# EasyEDA schematic SCH_Infotiv_2023-08-07.json
TITLE: Sheet_1; REV: 1.0; Date: 2023-07-14; Sheet: 1/1; Drawn By: Seamus; Company: Your Company
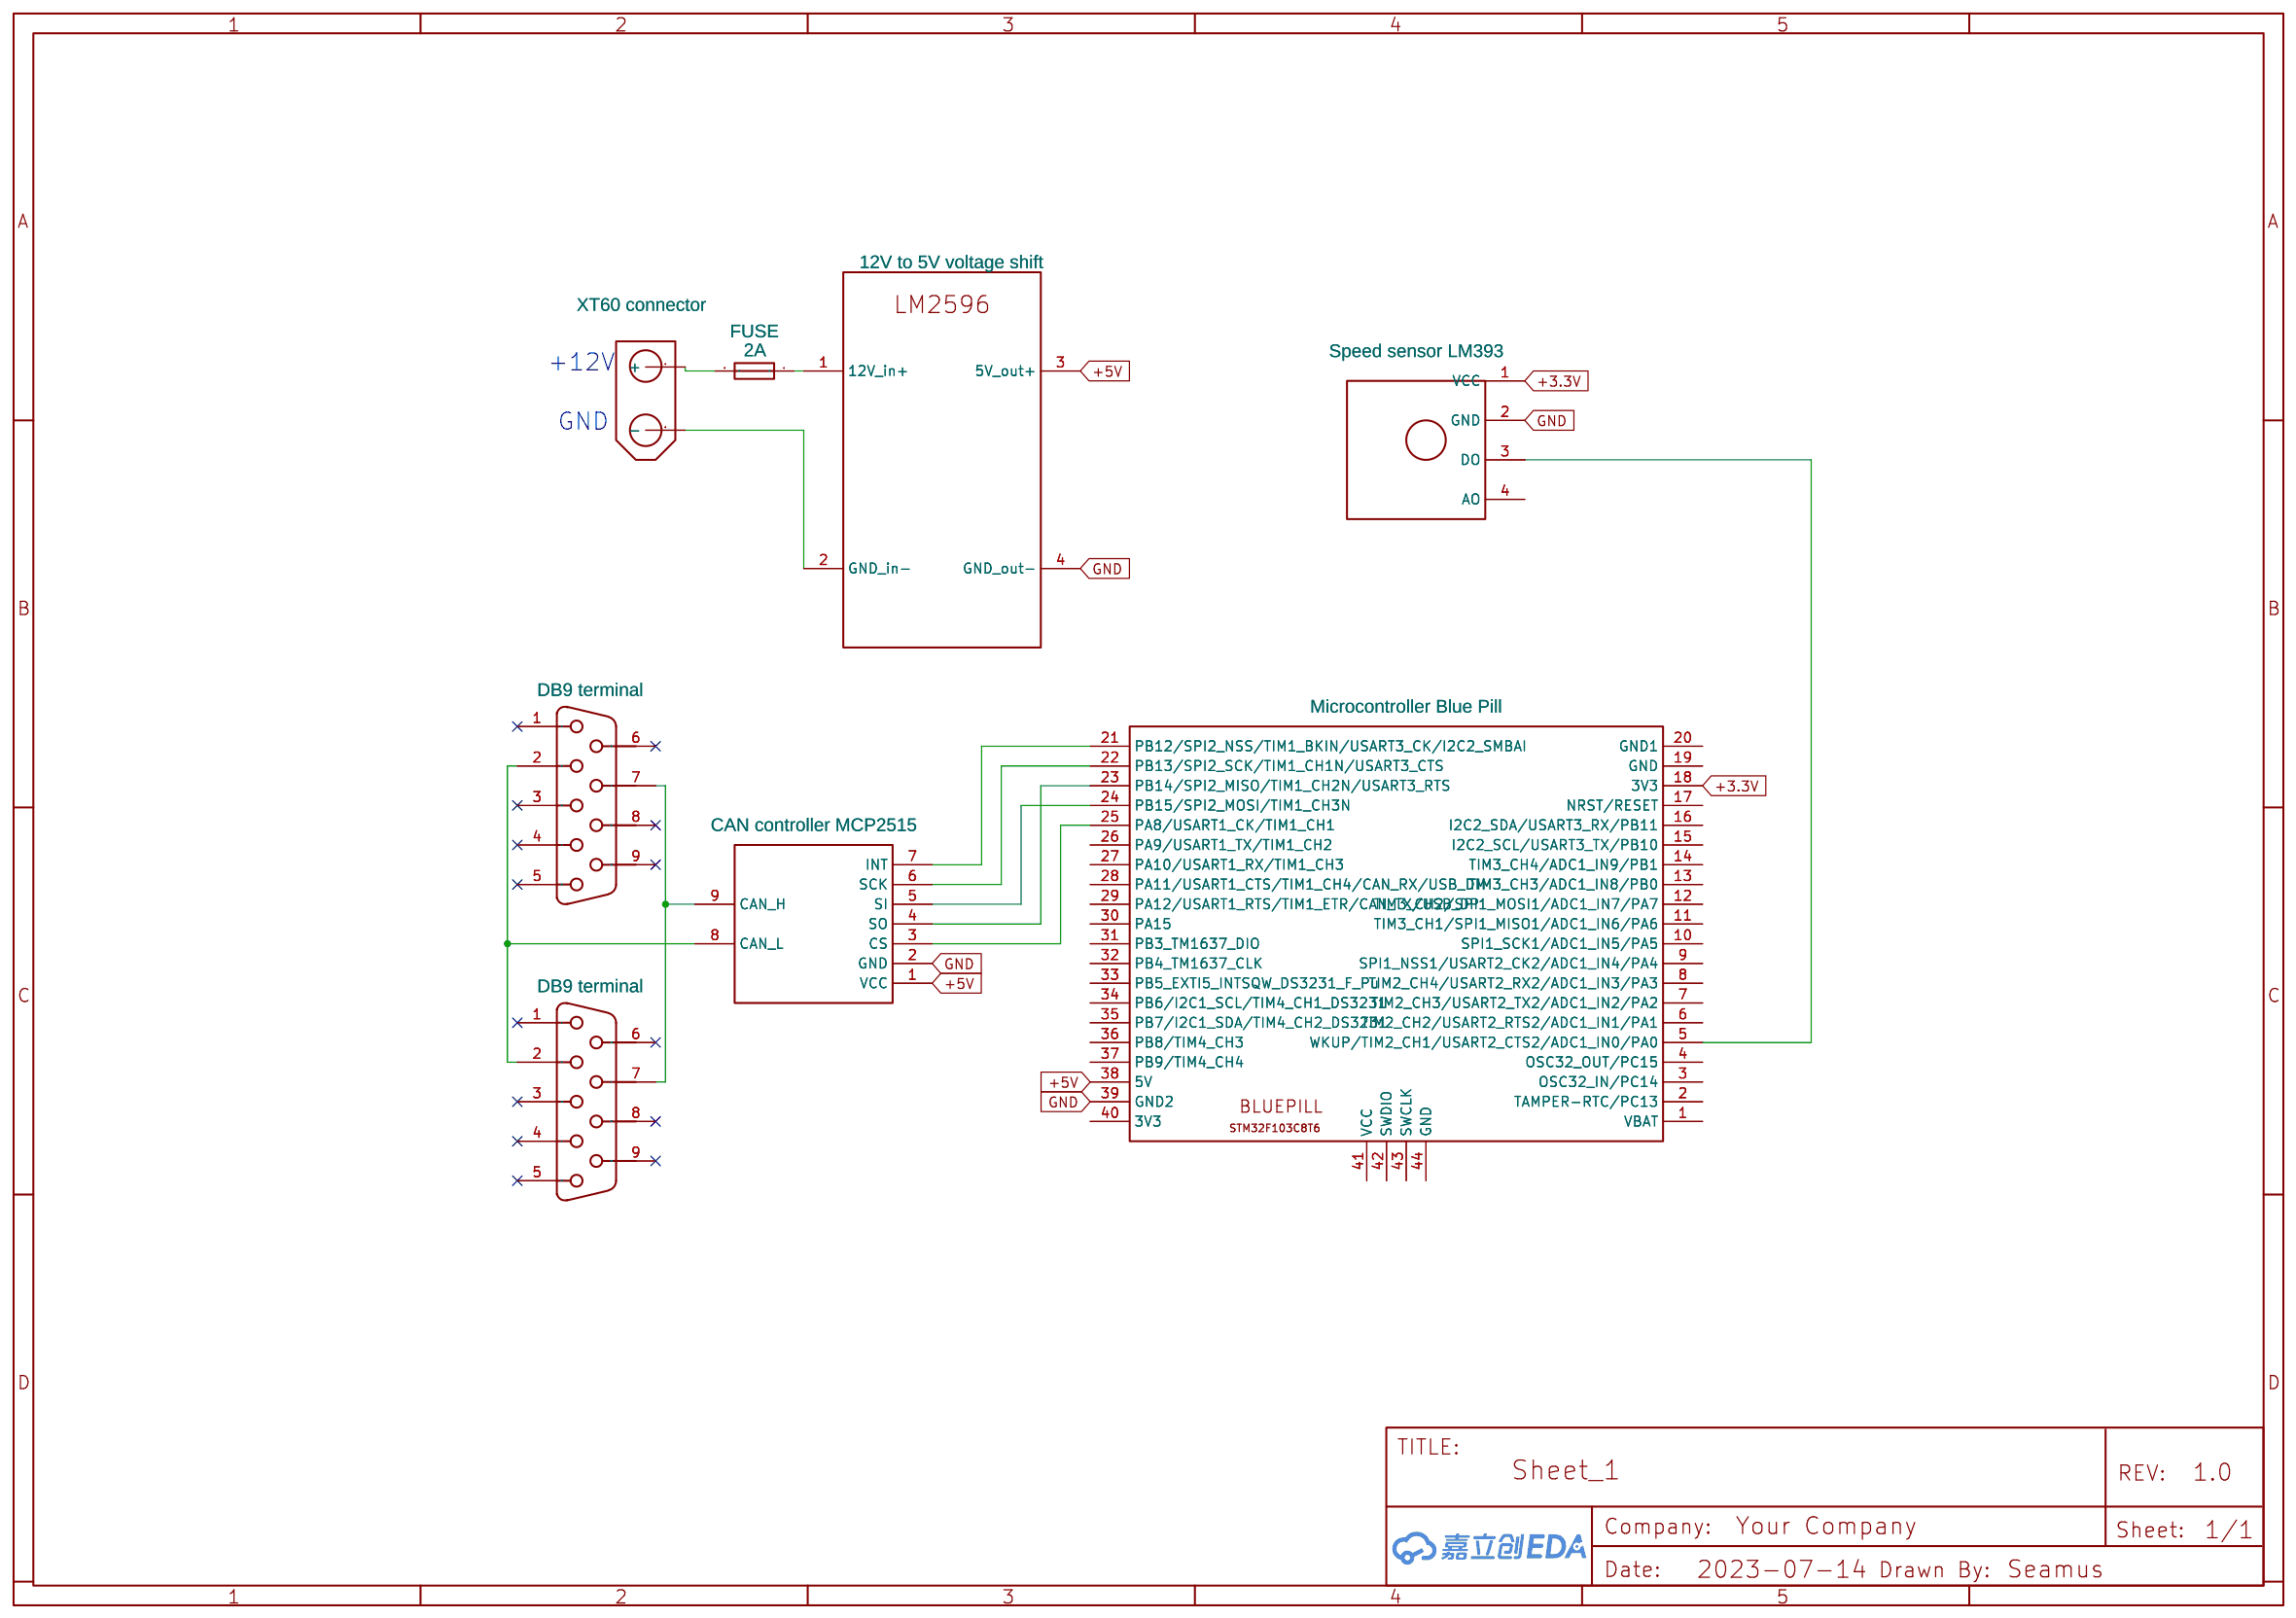
[diagram p0: schematic sheet]

## Parts
CN1  XT60 connector  [XT60PWE]
FUSE  2A  [FUSE-SMD_L6.1-W2.7]
U2  CAN controller MCP2515  [MCP2515_FLIPPED]
U3  12V to 5V voltage shift  [LM2596]
U4  Speed sensor LM393  [LM393-MODULE-4PIN PCB]
U5  Microcontroller Blue Pill  [MY_BLUEPILL]
U8  DB9 terminal  [DB9-TH_DB9SS]
U9  DB9 terminal  [DB9-TH_DB9SS]

## Library data of the parts
CN1 = XT60PWE: Supplier: LCSC; Supplier Part: C98732; Manufacturer: Changzhou Amass Elec; Contributor: caprinus
FUSE = 0448008.MR: Supplier: LCSC; Supplier Part: C187548; Manufacturer: Littelfuse; Contributor: Павел Колесов; JLCPCB Part Class: Extended Part
U2 = MCP2515 COPY: Contributor: technont64; Package Display: No
U3 = LM2596: link: http://www.alldatasheet.com/datasheet-pdf/pdf/8744/NSC/LM2596.html; Contributor: 7upers
U4 = LM393-MODULE-4PIN (JPAP): Contributor: Tribu Tech; Package Display: No
U5 = My_BluePill_2: Contributor: MykolaSa
U8 U9 = DB9 female: Supplier: LCSC; Supplier Part: C2911600; Manufacturer: null; Manufacturer Part: DB9SS 直插公座; JLCPCB Part Class: Extended Part; Contributor: carbo14

## Nets
+3.3V: U4.1(VCC) U5.18(3V3)
+5V: U2.1(VCC) U3.3(5V out+) U5.38(5V)
GND: U2.2(GND) U3.4(GND out-) U4.2(GND) U5.39(GND2)
Net-(CN1-1): CN1.1(+) FUSE.2
Net-(CN1-2): CN1.2(-) U3.2(GND in-)
Net-(FUSE-1): FUSE.1 U3.1(12V in+)
Net-(U2-3): U2.3(CS) U5.25(PA8/USART1_CK/TIM1_CH1)
Net-(U2-4): U2.4(SO) U5.23(PB14/SPI2_MISO/TIM1_CH2N/USART3_RTS)
Net-(U2-5): U2.5(SI) U5.24(PB15/SPI2_MOSI/TIM1_CH3N)
Net-(U2-6): U2.6(SCK) U5.22(PB13/SPI2_SCK/TIM1_CH1N/USART3_CTS)
Net-(U2-7): U2.7(INT) U5.21(PB12/SPI2_NSS/TIM1_BKIN/USART3_CK/I2C2_SMBAI)
Net-(U2-8): U2.8(CAN_L) U8.2 U9.2
Net-(U2-9): U2.9(CAN_H) U8.7 U9.7
Net-(U4-3): U4.3(DO) U5.5(WKUP/TIM2_CH1/USART2_CTS2/ADC1_IN0/PA0)

Not connected (* = marked no-connect by the designer): U4 4(AO); U5 1(VBAT) 2(TAMPER-RTC/PC13) 3(OSC32_IN/PC14) 4(OSC32_OUT/PC15) 6(TIM2_CH2/USART2_RTS2/ADC1_IN1/PA1) 7(TIM2_CH3/USART2_TX2/ADC1_IN2/PA2) 8(TIM2_CH4/USART2_RX2/ADC1_IN3/PA3) 9(SPI1_NSS1/USART2_CK2/ADC1_IN4/PA4) 10(SPI1_SCK1/ADC1_IN5/PA5) 11(TIM3_CH1/SPI1_MISO1/ADC1_IN6/PA6) 12(TIM3_CH2/SPI1_MOSI1/ADC1_IN7/PA7) 13(TIM3_CH3/ADC1_IN8/PB0) 14(TIM3_CH4/ADC1_IN9/PB1) 15(I2C2_SCL/USART3_TX/PB10) 16(I2C2_SDA/USART3_RX/PB11) 17(NRST/RESET) 19(GND) 20(GND1) 26(PA9/USART1_TX/TIM1_CH2) 27(PA10/USART1_RX/TIM1_CH3) 28(PA11/USART1_CTS/TIM1_CH4/CAN_RX/USB_DM) 29(PA12/USART1_RTS/TIM1_ETR/CAN_TX/USB_DP) 30(PA15) 31(PB3_TM1637_DIO) 32(PB4_TM1637_CLK) 33(PB5_EXTI5_INTSQW_DS3231_F_Pu) 34(PB6/I2C1_SCL/TIM4_CH1_DS3231) 35(PB7/I2C1_SDA/TIM4_CH2_DS3231) 36(PB8/TIM4_CH3) 37(PB9/TIM4_CH4) 40(3V3) 41(VCC) 42(SWDIO) 43(SWCLK) 44(GND); U8 1* 3* 4* 5* 6* 8* 9*; U9 1* 3* 4* 5* 6* 8* 9*

## Notes on the sheet
- +12V
- GND
